# Altium schematic sheet APA102.SchDoc
size A; SheetNumber: 3; SheetTotal: 3
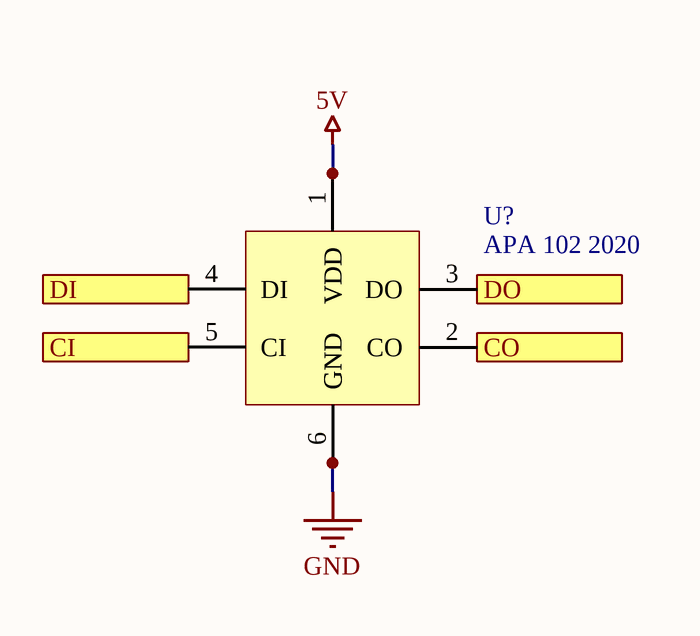
[diagram p0: APA102.SchDoc]

## Parts
U?  APA 102 2020  [LED_APA-102-2020-256-8]

## Ports
CI (in), CO (out), DI (in), DO (out)

## Nets
5V: U?.1(VDD) U?.8(VDD)
GND: U?.6(GND) U?.7(GND)
CI: U?.5(CI) ; port CI
CO: U?.2(CO) ; port CO
DI: U?.4(DI) ; port DI
DO: U?.3(DO) ; port DO

## Library data of the parts
U? = APA-102-2020-256-8: 8-pin type LED three-color RGB Dimming control; MF: iPixel LED Light Co.; MP: APA-102-2020-256-8; Value: *; SnapEDA_Link: https://www.snapeda.com/parts/APA-102-2020-256-8/iPixel%20LED%20Light%20Co./view-part/698331/?ref=snap; Availability: Unavailable; Package: SMD-8 iPixel LED Light Co.; Price: None